# Altium schematic sheet 17.RK3568_VO Interface_1.SchDoc
size 420 x 297 mm
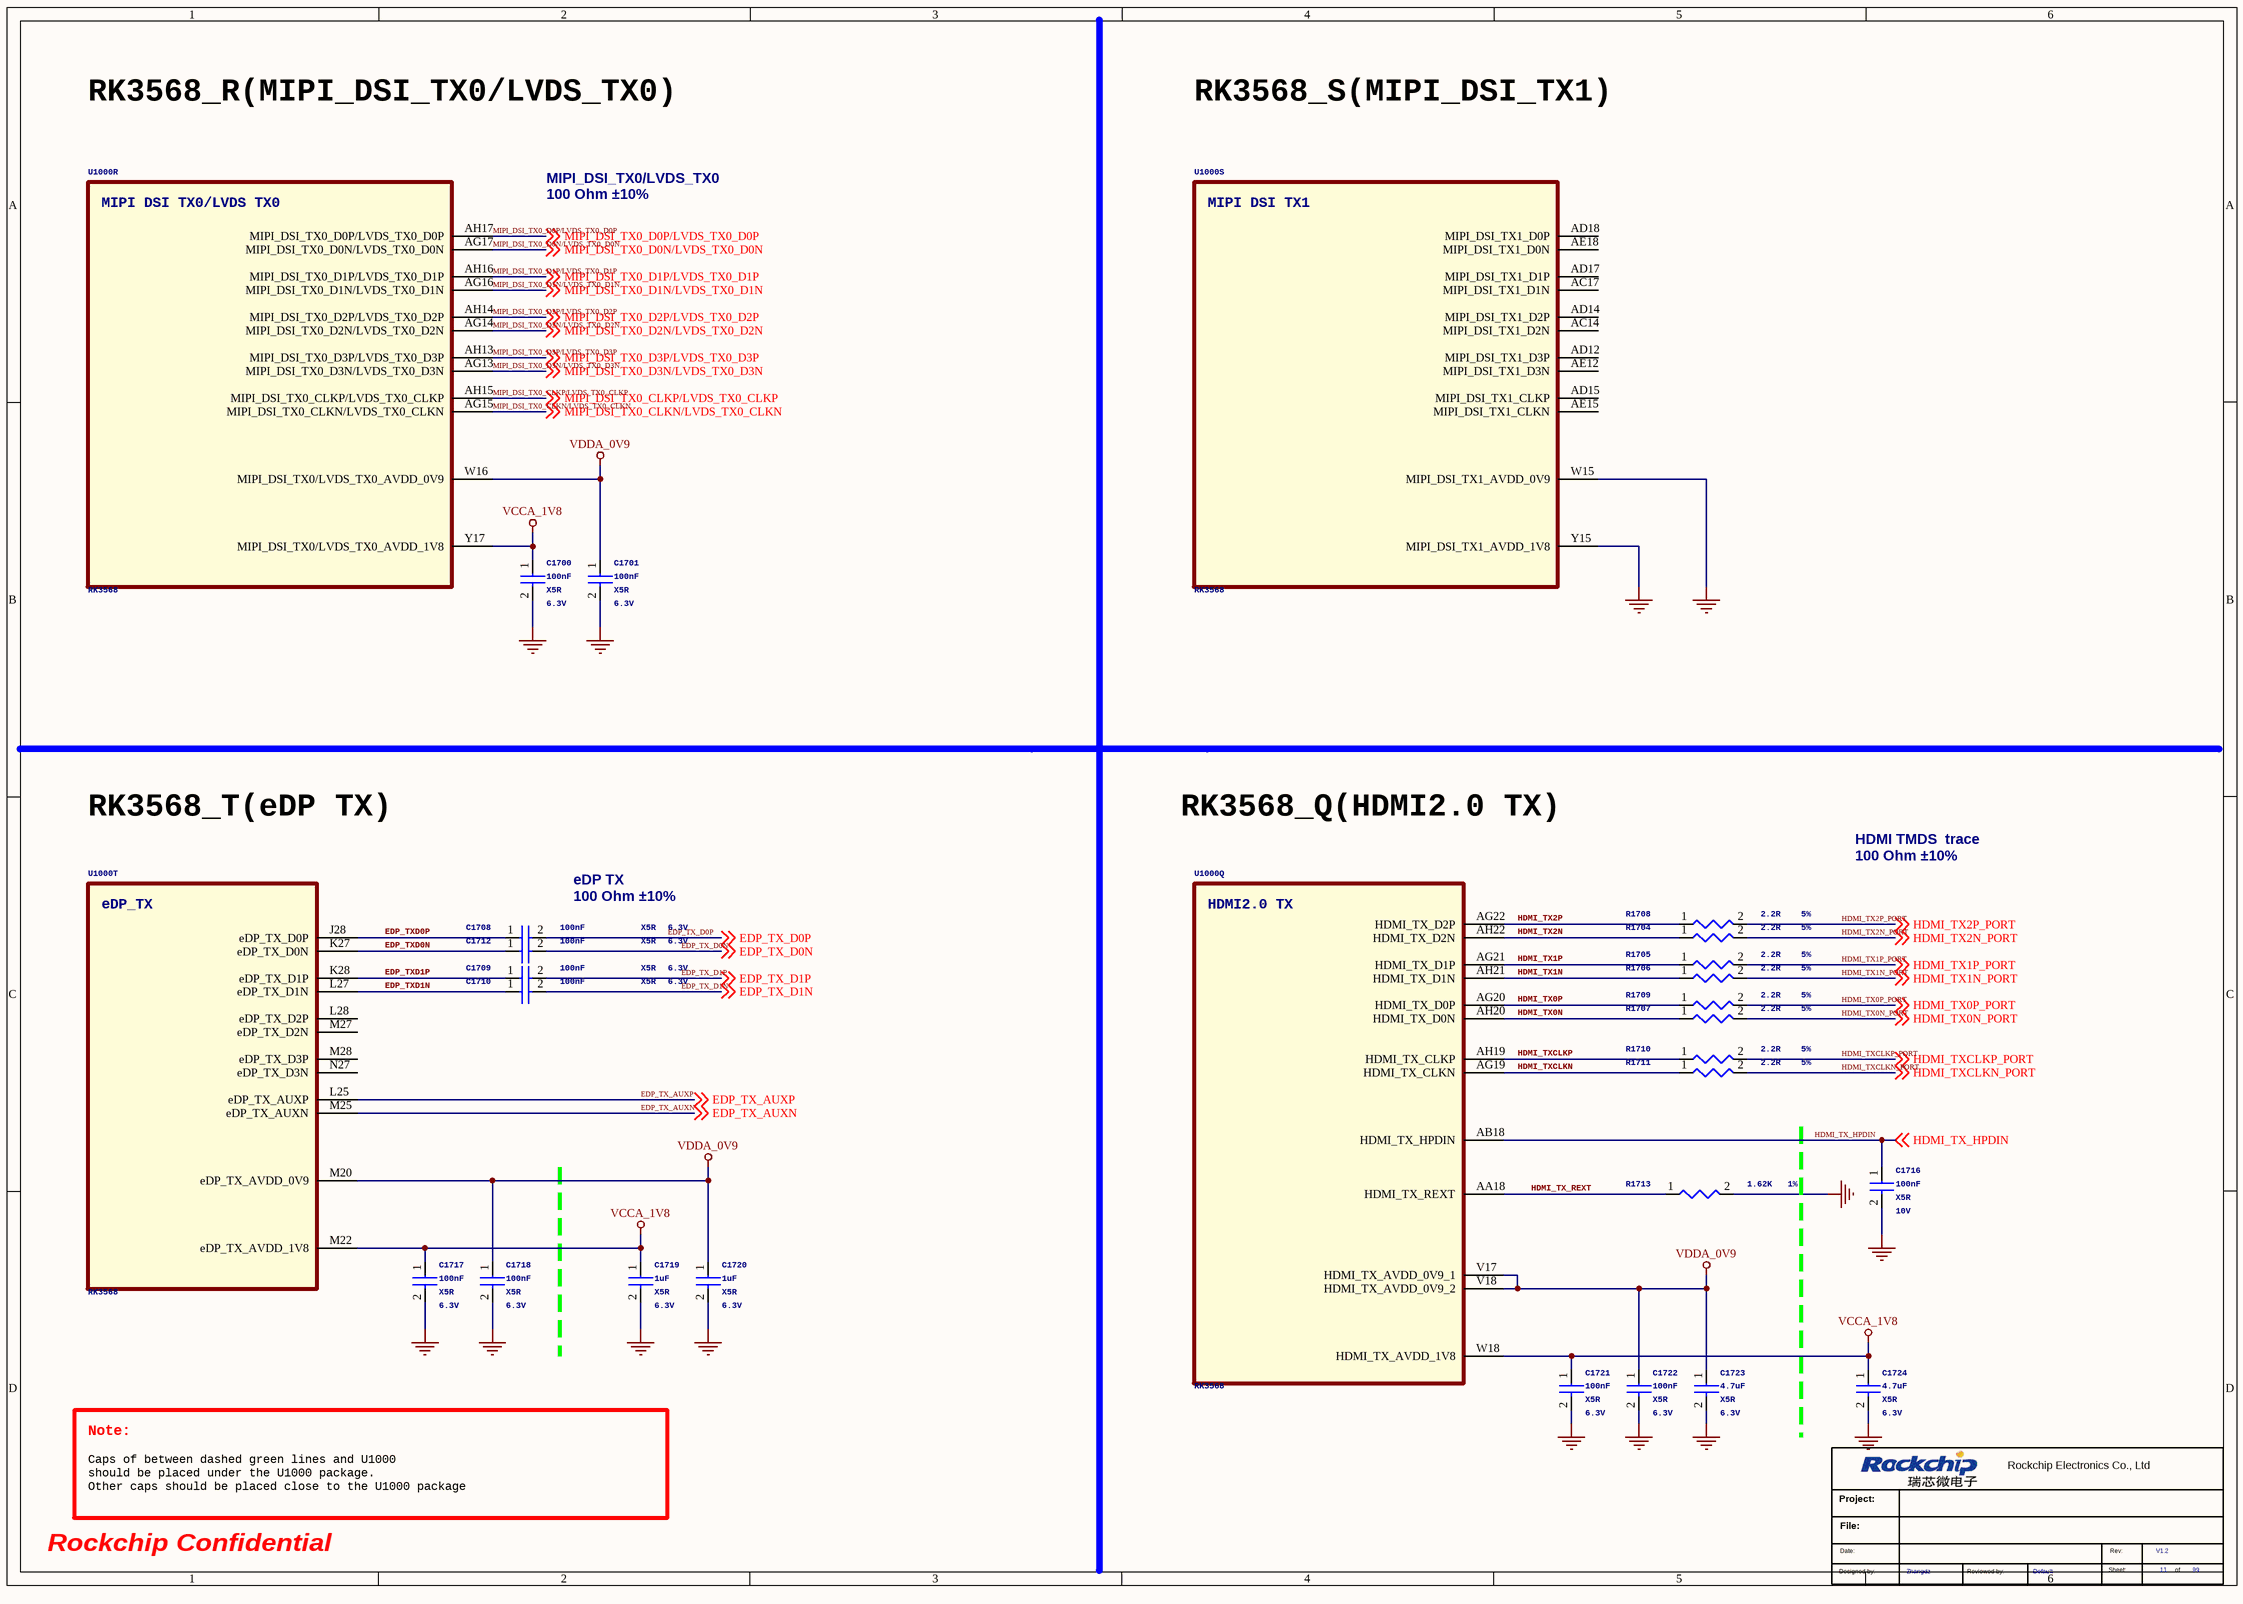
[diagram p0: 17.RK3568_VO Interface_1.SchDoc]

## Parts
*  Schematic Page Count: 99  Schematic Page Number: 11  Designer: Zhangdz  Revision: V1.2  Check: Default  (hidden comment: Rockchip_new)  (graphical)
C1700  100nF  Voltage: 6.3V  Dielectric: X5R  [C0201]
C1701  100nF  Voltage: 6.3V  Dielectric: X5R  [C0201]
C1708  100nF  Voltage: 6.3V  Dielectric: X5R  [C0201]
C1709  100nF  Voltage: 6.3V  Dielectric: X5R  [C0201]
C1710  100nF  Voltage: 6.3V  Dielectric: X5R  [C0201]
C1712  100nF  Voltage: 6.3V  Dielectric: X5R  [C0201]
C1716  100nF  Voltage: 10V  Dielectric: X5R  [C0402]
C1717  100nF  Voltage: 6.3V  Dielectric: X5R  [C0201]
C1718  100nF  Voltage: 6.3V  Dielectric: X5R  [C0201]
C1719  1uF  Voltage: 6.3V  Dielectric: X5R  [C0402]
C1720  1uF  Voltage: 6.3V  Dielectric: X5R  [C0402]
C1721  100nF  Voltage: 6.3V  Dielectric: X5R  [C0201]
C1722  100nF  Voltage: 6.3V  Dielectric: X5R  [C0201]
C1723  4.7uF  Voltage: 6.3V  Dielectric: X5R  [C0402]
C1724  4.7uF  Voltage: 6.3V  Dielectric: X5R  [C0402]
R1704  2.2R  Tolerance: 5%  [R0402]
R1705  2.2R  Tolerance: 5%  [R0402]
R1706  2.2R  Tolerance: 5%  [R0402]
R1707  2.2R  Tolerance: 5%  [R0402]
R1708  2.2R  Tolerance: 5%  [R0402]
R1709  2.2R  Tolerance: 5%  [R0402]
R1710  2.2R  Tolerance: 5%  [R0402]
R1711  2.2R  Tolerance: 5%  [R0402]
R1713  1.62K  Tolerance: 1%  [R0201]
U1000  RK3568  [BGA636_19R00X19R00X1R20]  (parts Q,R,S,T of 23)

## Nets
GND: C1700.2 C1701.2 C1716.2 C1717.2 C1718.2 C1719.2 C1720.2 C1721.2 C1722.2 C1723.2 C1724.2 R1713.2 U1000.W15(MIPI_DSI_TX1_AVDD_0V9) U1000.Y15(MIPI_DSI_TX1_AVDD_1V8)
VCCA_1V8: C1700.1 C1717.1 C1719.1 C1721.1 C1724.1 U1000.M22(eDP_TX_AVDD_1V8) U1000.W18(HDMI_TX_AVDD_1V8) U1000.Y17(MIPI_DSI_TX0/LVDS_TX0_AVDD_1V8)
VDDA_0V9: C1701.1 C1718.1 C1720.1 C1722.1 C1723.1 U1000.M20(eDP_TX_AVDD_0V9) U1000.V17(HDMI_TX_AVDD_0V9_1) U1000.V18(HDMI_TX_AVDD_0V9_2) U1000.W16(MIPI_DSI_TX0/LVDS_TX0_AVDD_0V9)
EDP_TX_AUXN: U1000.M25(eDP_TX_AUXN) ; off-sheet EDP_TX_AUXN
EDP_TX_AUXP: U1000.L25(eDP_TX_AUXP) ; off-sheet EDP_TX_AUXP
EDP_TX_D0N: C1712.2 ; off-sheet EDP_TX_D0N
EDP_TX_D0P: C1708.2 ; off-sheet EDP_TX_D0P
EDP_TX_D1N: C1710.2 ; off-sheet EDP_TX_D1N
EDP_TX_D1P: C1709.2 ; off-sheet EDP_TX_D1P
EDP_TXD0N: C1712.1 U1000.K27(eDP_TX_D0N)
EDP_TXD0P: C1708.1 U1000.J28(eDP_TX_D0P)
EDP_TXD1N: C1710.1 U1000.L27(eDP_TX_D1N)
EDP_TXD1P: C1709.1 U1000.K28(eDP_TX_D1P)
HDMI_TX0N: R1707.1 U1000.AH20(HDMI_TX_D0N)
HDMI_TX0N_PORT: R1707.2 ; off-sheet HDMI_TX0N_PORT
HDMI_TX0P: R1709.1 U1000.AG20(HDMI_TX_D0P)
HDMI_TX0P_PORT: R1709.2 ; off-sheet HDMI_TX0P_PORT
HDMI_TX1N: R1706.1 U1000.AH21(HDMI_TX_D1N)
HDMI_TX1N_PORT: R1706.2 ; off-sheet HDMI_TX1N_PORT
HDMI_TX1P: R1705.1 U1000.AG21(HDMI_TX_D1P)
HDMI_TX1P_PORT: R1705.2 ; off-sheet HDMI_TX1P_PORT
HDMI_TX2N: R1704.1 U1000.AH22(HDMI_TX_D2N)
HDMI_TX2N_PORT: R1704.2 ; off-sheet HDMI_TX2N_PORT
HDMI_TX2P: R1708.1 U1000.AG22(HDMI_TX_D2P)
HDMI_TX2P_PORT: R1708.2 ; off-sheet HDMI_TX2P_PORT
HDMI_TX_HPDIN: C1716.1 U1000.AB18(HDMI_TX_HPDIN) ; off-sheet HDMI_TX_HPDIN
HDMI_TX_REXT: R1713.1 U1000.AA18(HDMI_TX_REXT)
HDMI_TXCLKN: R1711.1 U1000.AG19(HDMI_TX_CLKN)
HDMI_TXCLKN_PORT: R1711.2 ; off-sheet HDMI_TXCLKN_PORT
HDMI_TXCLKP: R1710.1 U1000.AH19(HDMI_TX_CLKP)
HDMI_TXCLKP_PORT: R1710.2 ; off-sheet HDMI_TXCLKP_PORT
MIPI_DSI_TX0_CLKN/LVDS_TX0_CLKN: U1000.AG15(MIPI_DSI_TX0_CLKN/LVDS_TX0_CLKN) ; off-sheet MIPI_DSI_TX0_CLKN/LVDS_TX0_CLKN
MIPI_DSI_TX0_CLKP/LVDS_TX0_CLKP: U1000.AH15(MIPI_DSI_TX0_CLKP/LVDS_TX0_CLKP) ; off-sheet MIPI_DSI_TX0_CLKP/LVDS_TX0_CLKP
MIPI_DSI_TX0_D0N/LVDS_TX0_D0N: U1000.AG17(MIPI_DSI_TX0_D0N/LVDS_TX0_D0N) ; off-sheet MIPI_DSI_TX0_D0N/LVDS_TX0_D0N
MIPI_DSI_TX0_D0P/LVDS_TX0_D0P: U1000.AH17(MIPI_DSI_TX0_D0P/LVDS_TX0_D0P) ; off-sheet MIPI_DSI_TX0_D0P/LVDS_TX0_D0P
MIPI_DSI_TX0_D1N/LVDS_TX0_D1N: U1000.AG16(MIPI_DSI_TX0_D1N/LVDS_TX0_D1N) ; off-sheet MIPI_DSI_TX0_D1N/LVDS_TX0_D1N
MIPI_DSI_TX0_D1P/LVDS_TX0_D1P: U1000.AH16(MIPI_DSI_TX0_D1P/LVDS_TX0_D1P) ; off-sheet MIPI_DSI_TX0_D1P/LVDS_TX0_D1P
MIPI_DSI_TX0_D2N/LVDS_TX0_D2N: U1000.AG14(MIPI_DSI_TX0_D2N/LVDS_TX0_D2N) ; off-sheet MIPI_DSI_TX0_D2N/LVDS_TX0_D2N
MIPI_DSI_TX0_D2P/LVDS_TX0_D2P: U1000.AH14(MIPI_DSI_TX0_D2P/LVDS_TX0_D2P) ; off-sheet MIPI_DSI_TX0_D2P/LVDS_TX0_D2P
MIPI_DSI_TX0_D3N/LVDS_TX0_D3N: U1000.AG13(MIPI_DSI_TX0_D3N/LVDS_TX0_D3N) ; off-sheet MIPI_DSI_TX0_D3N/LVDS_TX0_D3N
MIPI_DSI_TX0_D3P/LVDS_TX0_D3P: U1000.AH13(MIPI_DSI_TX0_D3P/LVDS_TX0_D3P) ; off-sheet MIPI_DSI_TX0_D3P/LVDS_TX0_D3P

Not connected (* = marked no-connect by the designer): U1000 AC14(MIPI_DSI_TX1_D2N) AC17(MIPI_DSI_TX1_D1N) AD12(MIPI_DSI_TX1_D3P) AD14(MIPI_DSI_TX1_D2P) AD15(MIPI_DSI_TX1_CLKP) AD17(MIPI_DSI_TX1_D1P) AD18(MIPI_DSI_TX1_D0P) AE12(MIPI_DSI_TX1_D3N) AE15(MIPI_DSI_TX1_CLKN) AE18(MIPI_DSI_TX1_D0N) L28(eDP_TX_D2P) M27(eDP_TX_D2N) M28(eDP_TX_D3P) N27(eDP_TX_D3N)

## Notes on the sheet
- RK3568_R(MIPI_DSI_TX0/LVDS_TX0)
- RK3568_S(MIPI_DSI_TX1)
- MIPI_DSI_TX0/LVDS_TX0
  100 Ohm ±10%
- RK3568_T(eDP TX)
- RK3568_Q(HDMI2.0 TX)
- HDMI TMDS  trace
  100 Ohm ±10%
- eDP TX
  100 Ohm ±10%
- Note:
- Caps of between dashed green lines and U1000
  should be placed under the U1000 package.
  Other caps should be placed close to the U1000 package
- Rockchip Confidential
- (in symbol Rockchip_new) Rockchip Electronics Co., Ltd; Project:; File:; Date:; Rev:; Sheet:; of; Designed by:; Reviewed by:
- (in symbol SOC_RK3568, part Q) HDMI2.0 TX
- (in symbol SOC_RK3568, part R) MIPI DSI TX0/LVDS TX0
- (in symbol SOC_RK3568, part S) MIPI DSI TX1
- (in symbol SOC_RK3568, part T) eDP_TX

## Library data of the parts
* = Rockchip_new: Page Count: 37; Page Number: 14; Revcode: V1.2
C1700 C1710 C1712 C1717 C1722 = CAP NP: cap,100.00nF,+/-10%,6.3V,X5R,C0201; Manufacturer: TDK; RK PN: C0603X5R0J104K030BC; Priority: A; Tolerance: 10%; Part Type: C0201; Manufacturer PN: C0603X5R0J104K030BC; Created by: JJJ
C1701 C1708 C1709 C1718 C1721 = CAP NP: cap,100.00nF,+/-10%,6.3V,X5R,C0201; Manufacturer PN: C0603X5R0J104K030BC; Manufacturer: TDK; Tolerance: 10%; Priority: A; Created by: JJJ; Part Type: C0201; RK PN: C0603X5R0J104K030BC
C1716 = CAP NP: cap,100.00nF,+/-10%,10V,X5R,C0402; Manufacturer: TDK; RK PN: C1005X5R1A104K050BA; Priority: A; Tolerance: 10%; Part Type: C0402; Manufacturer PN: C1005X5R1A104K050BA; Created by: JJJ
C1719 = CAP NP: cap,1.00uF,+/-10%,6.3V,X5R,C0402; Manufacturer: TDK; RK PN: C1005X5R0J105K050BB; Priority: A; Tolerance: 10%; Part Type: C0402; Manufacturer PN: C1005X5R0J105K050BB; Created by: JJJ
C1720 = CAP NP: cap,1.00uF,+/-10%,6.3V,X5R,C0402; Manufacturer PN: C1005X5R0J105K050BB; Manufacturer: TDK; Tolerance: 10%; Priority: A; Created by: JJJ; Part Type: C0402; RK PN: C1005X5R0J105K050BB
C1723 = CAP NP: cap,4.70uF,+/-10%,6.3V,X5R,C0402; Manufacturer: TDK; RK PN: C1005X5R0J475K050BC; Priority: A; Tolerance: 10%; Part Type: C0402; Manufacturer PN: C1005X5R0J475K050BC; Created by: JJJ
C1724 = CAP NP: cap,4.70uF,+/-10%,6.3V,X5R,C0402; Manufacturer PN: C1005X5R0J475K050BC; Manufacturer: TDK; Tolerance: 10%; Priority: A; Created by: JJJ; Part Type: C0402; RK PN: C1005X5R0J475K050BC
R1704 R1707 R1710 R1711 = RESISTOR: 通用厚膜电阻,2R2,+/-5%,R0402,1/16W.; Manufacturer PN: RC0402JR-072R2L; Manufacturer: YAGEO; Wattage: 1/16W; Priority: A; Created by: YTL; Part Type: 通用厚膜电阻; RK PN: RC0402JR-072R2L
R1705 R1706 R1708 R1709 = RESISTOR: 通用厚膜电阻,2R2,+/-5%,R0402,1/16W.; Manufacturer: YAGEO; RK PN: RC0402JR-072R2L; Priority: A; Wattage: 1/16W; Part Type: 通用厚膜电阻; Manufacturer PN: RC0402JR-072R2L; Created by: YTL
R1713 = RESISTOR: 通用厚膜电阻,1K62,+/-1%,R0201,1/20W.; Manufacturer: YAGEO; RK PN: RC0201FR-071K62L; Priority: A; Wattage: 1/20W; Part Type: 通用厚膜电阻; Manufacturer PN: RC0201FR-071K62L; Created by: YTL
U1000 = SOC_RK3568: ROCKCHIP SOC; Manufacturer: Rockchip (瑞芯微); SPLIT_INST: TRUE; SWAP_INFO: (S1+S2+S3+S4+S5+S6+S7+S8+S9+S10+S11+S12+S13+S14+S15+S16+S17+S18+S19+S20+S21+S22+S23); Priority: A; Created by: JJJ; Manufacturer PN: RK3568; Part Type: SOC; RK PN: RK3568